# EAGLE design v0.2 (EAGLE 9.3.0)
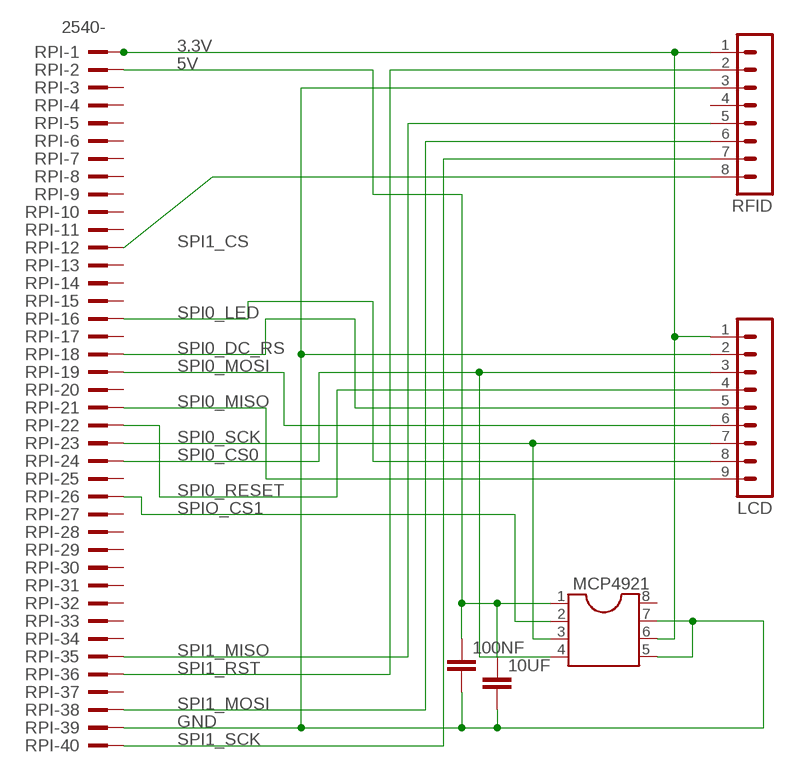
[diagram p0: schematic, sheet 1]

## Parts
10UF  C-EU025-025X050  [C025-025X050]
100NF  C-EU025-025X050  [C025-025X050]
LCD  MA09-1  [MA09-1]
MCP4921  DIL8  [DIL08]
RFID  MA08-1  [MA08-1]
RPI  2540-  [PAK100/2500-40]

## Nets
3.3V: LCD.1 MCP4921.6 RFID.1 RPI.1
5V: 10UF.1 100NF.1 MCP4921.1 RPI.2
GND: 10UF.2 100NF.2 LCD.2 MCP4921.5 MCP4921.7 RFID.3 RPI.39
SPI0_CS0: LCD.3 MCP4921.4 RPI.24
SPI0_DC_RS: LCD.5 RPI.18
SPI0_LED: LCD.8 RPI.16
SPI0_MISO: LCD.9 RPI.21
SPI0_MOSI: LCD.6 RPI.19
SPI0_RESET: LCD.4 RPI.22
SPI0_SCK: LCD.7 MCP4921.3 RPI.23
SPI1_CS: RFID.8 RPI.12
SPI1_MISO: RFID.5 RPI.35
SPI1_MOSI: RFID.6 RPI.38
SPI1_RST: RFID.2 RPI.36
SPI1_SCK: RFID.7 RPI.40
SPIO_CS1: MCP4921.2 RPI.26
Unconnected: MCP4921.8 RFID.4 RPI.3 RPI.4 RPI.5 RPI.6 RPI.7 RPI.8 RPI.9 RPI.10 RPI.11 RPI.13 RPI.14 RPI.15 RPI.17 RPI.20 RPI.25 RPI.27 RPI.28 RPI.29 RPI.30 RPI.31 RPI.32 RPI.33 RPI.34 RPI.37

## Library data of the parts
10UF 100NF = rcl:C-EU: CAPACITOR, European symbol; SPICEPREFIX: C
LCD = con-lstb:MA09-1: PIN HEADER; OC_FARNELL: unknown; OC_NEWARK: unknown
MCP4921 = ic-package:DIL8: Dual In Line / Socket
RFID = con-lstb:MA08-1: PIN HEADER; OC_FARNELL: unknown; OC_NEWARK: unknown
RPI = con-3m:2540-: 3M (TM) Pak 100 4-Wall Header Source: 3M; OC_FARNELL: unknown; OC_NEWARK: unknown

## Board
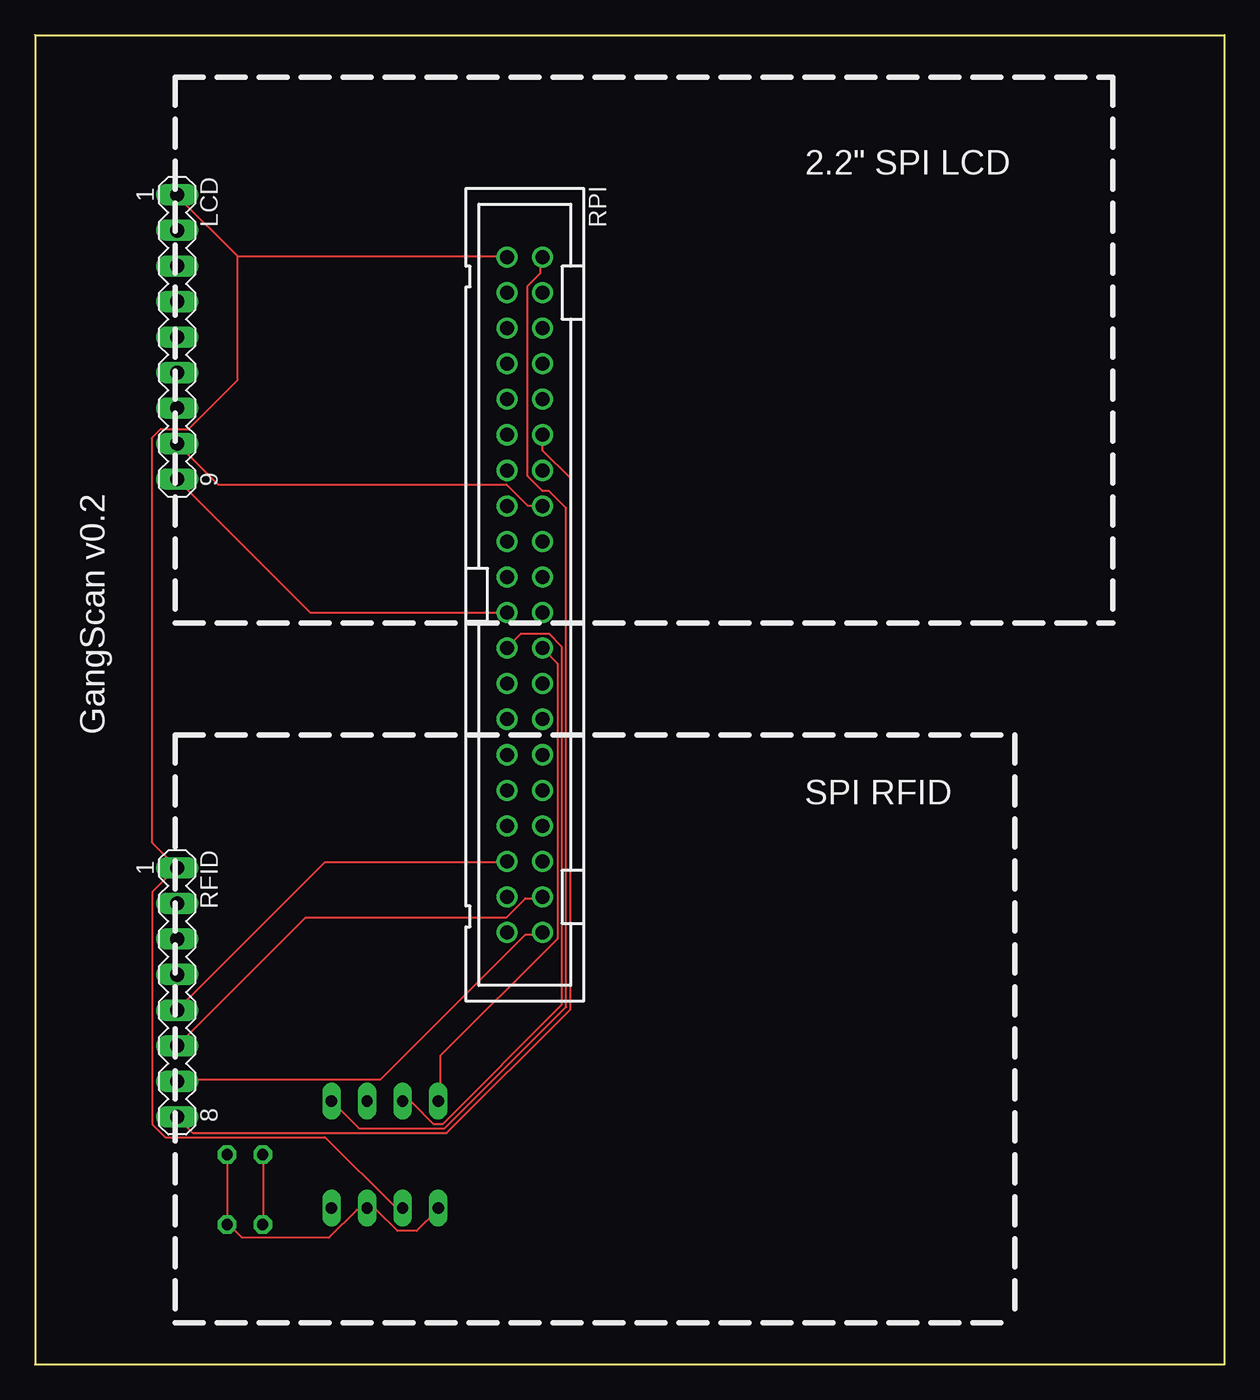
[diagram p1: board, top side]
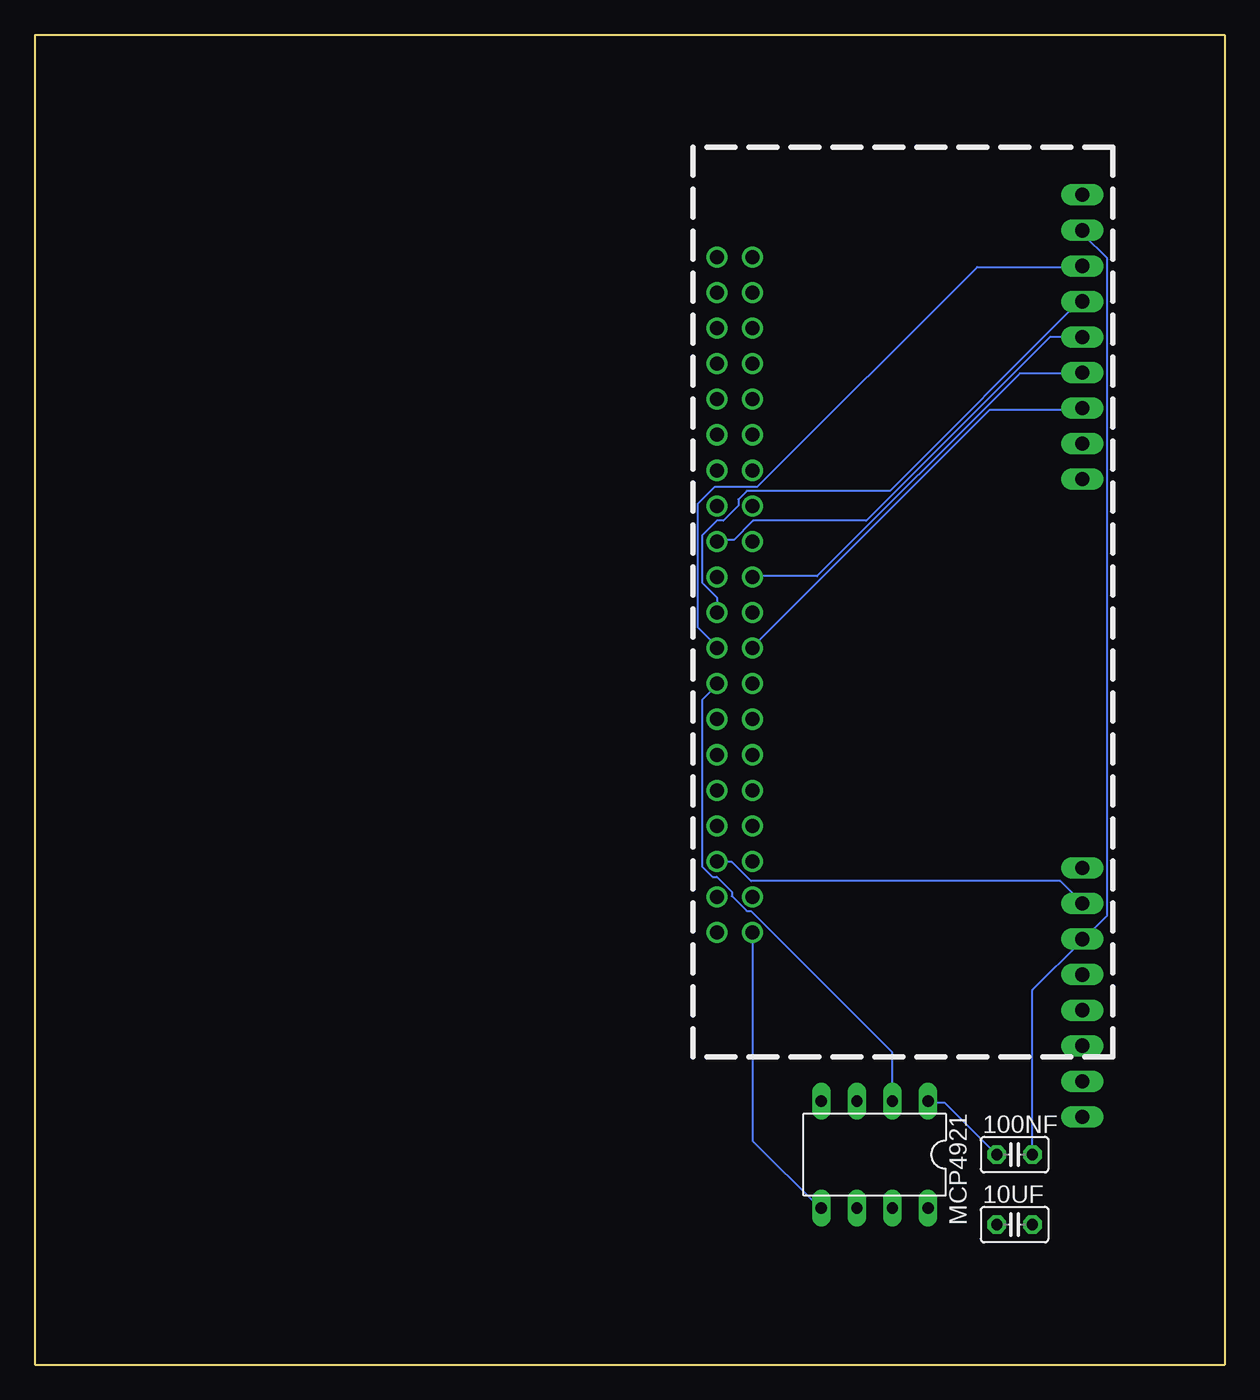
[diagram p2: board, bottom side, seen from below]

Size 85 x 95 mm. Coordinates in mm from the lower left corner, seen from the top.
Outline: 0,95 85,95 85,0 0,0 0,95
Copper layers (1*16): Top 0.035mm / dielectric 1.5mm / Bottom 0.035mm
Design rules "default": minimum track width 6mil, minimum drill 0.35mm, track to track 6mil, track to pad 6mil, pad to pad 6mil, via to via 6mil, smd to smd 6mil, copper to edge 40mil, drill to drill 6mil, minimum pad ring 10mil, minimum via ring 8mil, stop-mask expansion 4mil, vias tented up to drill 0mil, thermal gap 10mil

### Footprints (pad centres in the part's own frame; a part is rotated, then mirrored left to right if it is on the bottom)
C025-025X050 = drill 0.813 octagon: 1 -1.27,0; 2 1.27,0
MA09-1 = drill 1.016 long: 1 -10.16,0; 2 -7.62,0; 3 -5.08,0; 4 -2.54,0; 5 0,0; 6 2.54,0; 7 5.08,0; 8 7.62,0; 9 10.16,0
DIL08 = drill 0.813 long: 1 -3.81,-3.81; 2 -1.27,-3.81; 3 1.27,-3.81; 4 3.81,-3.81; 5 3.81,3.81; 6 1.27,3.81; 7 -1.27,3.81; 8 -3.81,3.81
MA08-1 = drill 1.016 long: 1 -8.89,0; 2 -6.35,0; 3 -3.81,0; 4 -1.27,0; 5 1.27,0; 6 3.81,0; 7 6.35,0; 8 8.89,0
PAK100/2500-40 = drill 1 pad 1.422: 1 -24.13,-1.27; 2 -24.13,1.27; 3 -21.59,-1.27; 4 -21.59,1.27; 5 -19.05,-1.27; 6 -19.05,1.27; 7 -16.51,-1.27; 8 -16.51,1.27; 9 -13.97,-1.27; 10 -13.97,1.27; 11 -11.43,-1.27; 12 -11.43,1.27; 13 -8.89,-1.27; 14 -8.89,1.27; 15 -6.35,-1.27; 16 -6.35,1.27; 17 -3.81,-1.27; 18 -3.81,1.27; 19 -1.27,-1.27; 20 -1.27,1.27; 21 1.27,-1.27; 22 1.27,1.27; 23 3.81,-1.27; 24 3.81,1.27; 25 6.35,-1.27; 26 6.35,1.27; 27 8.89,-1.27; 28 8.89,1.27; 29 11.43,-1.27; 30 11.43,1.27; 31 13.97,-1.27; 32 13.97,1.27; 33 16.51,-1.27; 34 16.51,1.27; 35 19.05,-1.27; 36 19.05,1.27; 37 21.59,-1.27; 38 21.59,1.27; 39 24.13,-1.27; 40 24.13,1.27

### Placement (x,y rotation side)
10UF  15,10 0 bottom
100NF  15,15 0 bottom
LCD  10.16,73.42 270 top
MCP4921  25,15 180 bottom
RFID  10.16,26.59 270 top
RPI  35,55 270 top

### Tracks (layer width: path | path; a pad name or v marks a point on that pad's centre or on a via)
3.3V
  Top 0.152: 14.48,79.19 33.68,79.19 RPI.1 | 14.48,79.19 10.21,83.46 LCD.1 | MCP4921.6 26.21,11.22 25.76,11.22 20.73,16.25 9.3,16.25 8.38,17.16 8.38,33.77 10.06,35.45 RFID.1 10.06,35.6 8.38,37.28 8.38,66.24 8.99,66.84 10.97,66.84 14.48,70.35 14.48,79.19
5V
  Top 0.152: 10UF.1 16.31,10 16.31,14.88 100NF.1 | RPI.2 36.12,79.04 36.12,77.97 35.2,77.06 35.2,63.49 36.27,62.43 36.73,62.43 37.95,61.21 37.95,25.55 29.26,16.86 23.16,16.86 21.34,18.69 MCP4921.1
  Bottom 0.152: MCP4921.1 21.18,18.69 19.96,18.69 16.31,15.03 100NF.1
GND
  Top 0.152: MCP4921.5 28.8,11.07 27.28,9.54 25.91,9.54 24.38,11.07 23.77,11.07 MCP4921.7 23.62,11.07 23.01,11.07 21.03,9.09 14.78,9.09 13.87,10 10UF.2 13.72,10 13.72,14.88 100NF.2
  Bottom 0.152: RPI.39 33.68,30.73 33.68,15.94 28.96,11.22 MCP4921.5 | 100NF.2 13.72,15.03 13.72,26.76 10.21,30.27 RFID.3 10.06,30.42 8.38,32.1 8.38,79.04 10.06,80.71 10.06,81.02 LCD.2
SPI0_CS0
  Top 0.152: MCP4921.4 28.96,18.84 28.96,22.04 37.34,30.42 37.34,50.08 36.27,51.15 RPI.24
  Bottom 0.152: LCD.3 10.21,78.43 17.68,78.43 33.38,62.73 36.42,62.73 37.64,61.51 37.64,52.67 36.27,51.3 RPI.24
SPI0_DC_RS
  Bottom 0.152: RPI.18 36.12,58.92 35.05,58.92 33.68,60.29 25.6,60.29 12.5,73.4 10.21,73.4 LCD.5
SPI0_LED
  Top 0.152: RPI.16 36.12,61.36 35.2,61.36 33.68,62.88 13.11,62.88 10.21,65.78 LCD.8
SPI0_MISO
  Top 0.152: RPI.21 33.68,53.74 19.66,53.74 10.21,63.19 LCD.9
SPI0_MOSI
  Bottom 0.152: RPI.19 33.68,56.33 29.11,56.33 14.63,70.81 10.21,70.81 LCD.6
SPI0_RESET
  Bottom 0.152: RPI.22 36.27,54.81 37.34,55.87 37.34,59.23 36.27,60.29 35.81,60.29 34.75,61.36 34.75,61.82 34.14,62.43 23.93,62.43 10.52,75.84 10.21,75.84 LCD.4
SPI0_SCK
  Top 0.152: MCP4921.3 26.36,18.69 26.98,18.69 28.5,17.16 29.11,17.16 37.64,25.7 37.64,51.3 36.73,52.22 34.75,52.22 33.83,51.3 RPI.23
  Bottom 0.152: LCD.7 10.21,68.22 16.76,68.22 33.68,51.3 RPI.23
SPI1_CS
  Top 0.152: RPI.12 36.27,66.39 36.27,65.32 38.25,63.34 38.25,25.39 29.41,16.55 11.28,16.55 10.21,17.62 RFID.8
SPI1_MISO
  Top 0.152: RPI.35 33.68,35.91 20.73,35.91 10.21,25.39 RFID.5
SPI1_MOSI
  Top 0.152: RPI.38 36.12,33.32 35.05,33.32 33.68,31.95 19.36,31.95 10.21,22.8 RFID.6
SPI1_RST
  Bottom 0.152: RPI.36 36.12,35.91 35.2,35.91 33.83,34.54 11.73,34.54 10.21,33.01 RFID.2
SPI1_SCK
  Top 0.152: RPI.40 36.12,30.73 35.05,30.73 24.69,20.36 10.21,20.36 RFID.7
SPIO_CS1
  Bottom 0.152: MCP4921.2 23.77,18.84 23.77,22.34 33.83,32.4 34.14,32.4 35.2,33.47 35.2,33.77 36.27,34.84 36.58,34.84 37.34,35.6 37.34,47.49 36.27,48.56 RPI.26

### Text on the board
tPlace: 2.2" SPI LCD | GangScan v0.2 | SPI RFID